# Altium schematic sheet Single Color Controller TC1321.SchDoc
size A4
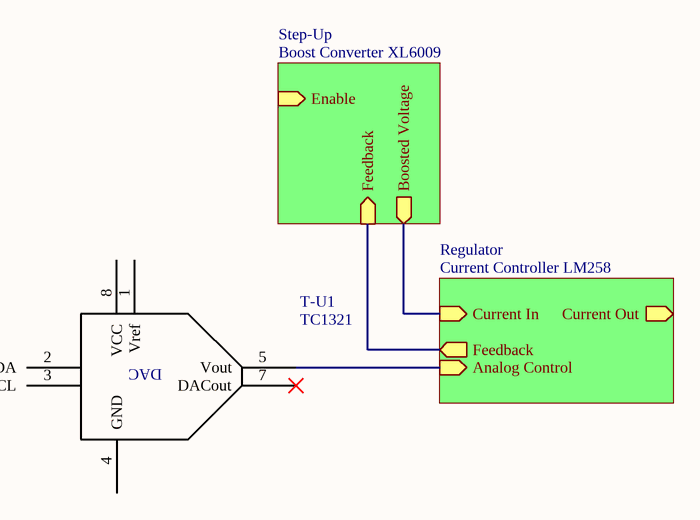
[diagram p0: Single Color Controller TC1321.SchDoc]

## Parts
T-U1  TC1321  [SOIC-8]

## Sub-sheets
Regulator = Current Controller LM258: Analog Control (in), Current In (in), Current Out (out), Feedback (out)
Step-Up = Boost Converter XL6009: Enable (in), Feedback (in), Boosted Voltage (out)

## Nets
NetT-U1_5: T-U1.5(Vout) ; sheet Regulator/Analog Control
(unnamed): sheet Regulator/Current In, sheet Step-Up/Boosted Voltage
(unnamed): sheet Regulator/Feedback, sheet Step-Up/Feedback

Not connected (* = marked no-connect by the designer): T-U1 1(Vref) 2(SDA) 3(SCL) 4(GND) 7(DACout)* 8(VCC)

## Notes on the sheet
- (in symbol TC1321) DAC

## Library data of the parts
T-U1 = TC1321: DAC 10-Bit Two-Wire